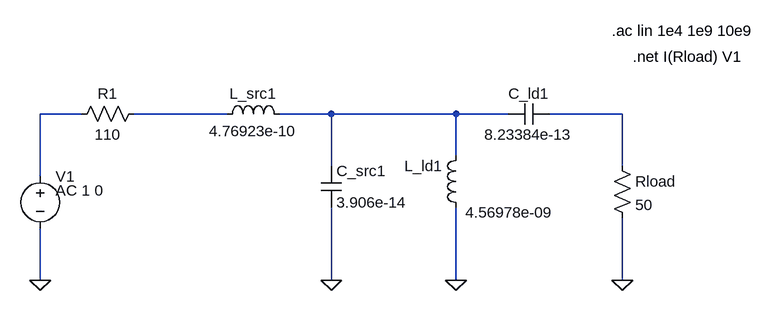
[diagram p0: schematic matching_network.asc]
matching_network.asc, the LTspice schematic file:
Version 4
SHEET 1 1264 680
WIRE 160 224 96 224
WIRE 384 224 240 224
WIRE 544 224 464 224
WIRE 736 224 544 224
WIRE 816 224 736 224
WIRE 992 224 880 224
WIRE 736 288 736 224
WIRE 544 304 544 224
WIRE 992 304 992 224
WIRE 96 320 96 224
WIRE 96 480 96 400
WIRE 544 480 544 368
WIRE 736 480 736 368
WIRE 992 480 992 384
FLAG 544 480 0
FLAG 736 480 0
FLAG 992 480 0
FLAG 96 480 0
SYMBOL ind 368 240 R270
WINDOW 0 32 56 VTop 2
WINDOW 3 5 56 VBottom 2
SYMATTR InstName L_src1
SYMATTR Value 4.76923e-10
SYMBOL ind 752 384 R180
WINDOW 0 36 80 Left 2
WINDOW 3 -135 8 Left 2
SYMATTR InstName L_ld1
SYMATTR Value 4.56978e-09
SYMBOL cap 528 304 R0
SYMATTR InstName C_src1
SYMATTR Value 3.906e-14
SYMBOL cap 880 208 R90
WINDOW 0 0 32 VBottom 2
WINDOW 3 32 32 VTop 2
SYMATTR InstName C_ld1
SYMATTR Value 8.23384e-13
SYMBOL Res 976 288 R0
SYMATTR InstName Rload
SYMATTR Value 50
SYMBOL Res 256 208 R90
WINDOW 0 0 56 VBottom 2
WINDOW 3 32 56 VTop 2
SYMATTR InstName R1
SYMATTR Value 110
SYMBOL voltage 96 304 R0
WINDOW 123 24 38 Left 2
SYMATTR InstName V1
SYMATTR Value ""
SYMATTR Value2 AC 1 0
TEXT 976 96 Left 2 !.ac lin 1e4 1e9 10e9
TEXT 1008 136 Left 2 !.net I(Rload) V1

The netlist it stands for:
* matching_network.asc
L_src1 N002 N003 4.76923e-10
L_ld1 0 N003 4.56978e-09
C_src1 N003 0 3.906e-14
C_ld1 N004 N003 8.23384e-13
Rload N004 0 50
R1 N002 N001 110
V1 N001 0 AC 1 0
.ac lin 1e4 1e9 10e9
.net I(Rload) V1
.backanno
.end